# Altium project DAPLink.PrjPcb
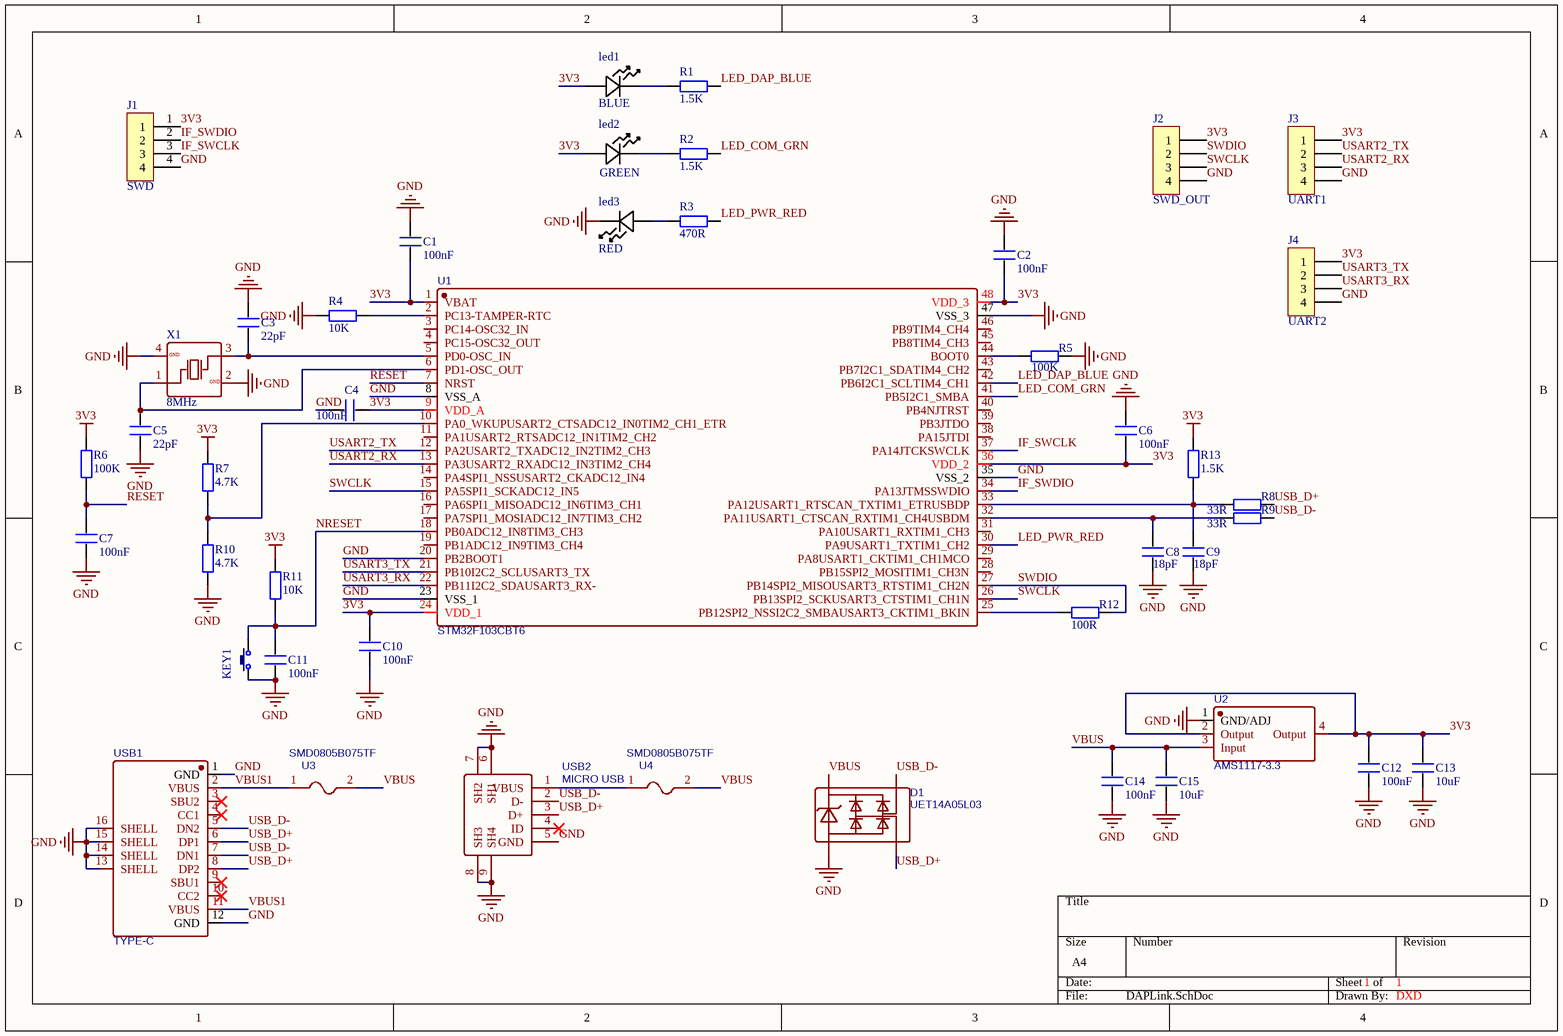
[diagram p0: DAPLink.SchDoc]
1 sheet, 44 parts. Net scope: global (net labels, ports and power ports of the same name join across sheets).
Board file: DAPLink.PcbDoc

## Sheet DAPLink.SchDoc
size A4; Author: DXD; DrawnBy: DXD; SheetNumber: 1; SheetTotal: 1

### Parts
C1  100nF  [0603_CAP]
C2  100nF  [0603_CAP]
C3  22pF  [0603_CAP]
C4  100nF  [0603_CAP]
C5  22pF  [0603_CAP]
C6  100nF  [0603_CAP]
C7  100nF  [0603_CAP]
C8  18pF  [0603_CAP]
C9  18pF  [0603_CAP]
C10  100nF  [0603_CAP]
C11  100nF  [0603_CAP]
C12  100nF  [0603_CAP]
C13  10uF  [0603_CAP]
C14  100nF  [0603_CAP]
C15  10uF  [0603_CAP]
D1  UET14A05L03  [SOT-143]
J1  SWD  [SWD]
J2  SWD_OUT  [XH2.54-4P]
J3  UART1  [XH2.54-4P]
J4  UART2  [XH2.54-4P]
KEY1  KEY  [KEY_TSW-2-2*4*3.5]  (value not drawn)
led1  BLUE  [0603_LED]
led2  GREEN  [0603_LED]
led3  RED  [0603_LED]
R1  1.5K  [0603_RES]
R2  1.5K  [0603_RES]
R3  470R  [0603_RES]
R4  10K  [0603_RES]
R5  100K  [0603_RES]
R6  100K  [0603_RES]
R7  4.7K  [0603_RES]
R8  33R  [0603_RES]
R9  33R  [0603_RES]
R10  4.7K  [0603_RES]
R11  10K  [0603_RES]
R12  100R  [0603_RES]
R13  1.5K  [0603_RES]
U1  STM32F103CBT6  [LQFP-48]
U2  AMS1117-3.3  [SOT-223]
U3  SMD0805B075TF  [F0805]
U4  SMD0805B075TF  [F0805]
USB1  TYPE-C  [TYPE-C]
USB2  MICRO USB  [MICRO-USB]
X1  8MHz  [XTAL-3225-4P]

### Nets
3V3: C1.1 C2.1 C4.1 C6.1 C10.2 C12.2 C13.2 J1.1 J2.1 J3.1 J4.1 led1.2 led2.2 R6.2 R7.2 R11.2 R13.2 U1.1(VBAT) U1.9(VDD_A) U1.24(VDD_1) U1.36(VDD_2) U1.48(VDD_3) U2.2(Output) U2.4(Output)
GND: C1.2 C2.2 C3.2 C4.2 C5.1 C6.2 C7.1 C8.1 C9.1 C10.1 C11.1 C12.1 C13.1 C14.1 C15.1 D1.1(A) J1.4 J2.4 J3.4 J4.4 KEY1.1 led3.1 R4.1 R5.2 R10.1 U1.8(VSS_A) U1.20(PB2BOOT1) U1.23(VSS_1) U1.35(VSS_2) U1.47(VSS_3) U2.1(GND/ADJ) USB1.1(GND) USB1.12(GND) USB1.13(SHELL) USB1.14(SHELL) USB1.15(SHELL) USB1.16(SHELL) USB2.5(GND) USB2.6(SH1) USB2.7(SH2) USB2.8(SH3) USB2.9(SH4) X1.2(GND) X1.4(GND)
IF_SWCLK: J1.3 U1.37(PA14JTCKSWCLK)
IF_SWDIO: J1.2 U1.34(PA13JTMSSWDIO)
LED_COM_GRN: R2.2 U1.41(PB5I2C1_SMBA)
LED_DAP_BLUE: R1.2 U1.42(PB6I2C1_SCLTIM4_CH1)
LED_PWR_RED: R3.2 U1.30(PA9USART1_TXTIM1_CH2)
NRESET: C11.2 KEY1.2 R11.1 U1.18(PB0ADC12_IN8TIM3_CH3)
RESET: C7.2 R6.1 U1.7(NRST)
SWCLK: J2.3 U1.15(PA5SPI1_SCKADC12_IN5) U1.26(PB13SPI2_SCKUSART3_CTSTIM1_CH1N)
SWDIO: J2.2 R12.2 U1.27(PB14SPI2_MISOUSART3_RTSTIM1_CH2N)
USART2_RX: J3.3 U1.13(PA3USART2_RXADC12_IN3TIM2_CH4)
USART2_TX: J3.2 U1.12(PA2USART2_TXADC12_IN2TIM2_CH3)
USART3_RX: J4.3 U1.22(PB11I2C2_SDAUSART3_RX-)
USART3_TX: J4.2 U1.21(PB10I2C2_SCLUSART3_TX)
USB_D+: D1.2 R8.2 USB1.6(DP1) USB1.8(DP2) USB2.3(D+)
USB_D-: D1.3 R9.2 USB1.5(DN2) USB1.7(DN1) USB2.2(D-)
VBUS: C14.2 C15.2 D1.4(K) U2.3(Input) U3.2 U4.2
VBUS1: U3.1 USB1.2(VBUS) USB1.11(VBUS)
NetC3_1: C3.1 U1.5(PD0-OSC_IN) X1.3(OSC2)
NetC5_2: C5.2 U1.6(PD1-OSC_OUT) X1.1(OSC1)
NetC8_2: C8.2 R9.1 U1.32(PA11USART1_CTSCAN_RXTIM1_CH4USBDM)
NetC9_2: C9.2 R8.1 R13.1 U1.33(PA12USART1_RTSCAN_TXTIM1_ETRUSBDP)
Netled1_1: led1.1 R1.1
Netled2_1: led2.1 R2.1
Netled3_2: led3.2 R3.1
NetR4_2: R4.2 U1.2(PC13-TAMPER-RTC)
NetR5_1: R5.1 U1.44(BOOT0)
NetR7_1: R7.1 R10.2 U1.10(PA0_WKUPUSART2_CTSADC12_IN0TIM2_CH1_ETR)
NetR12_1: R12.1 U1.25(PB12SPI2_NSSI2C2_SMBAUSART3_CKTIM1_BKIN)
NetU4_1: U4.1 USB2.1(VBUS)

Not connected (* = marked no-connect by the designer): U1 3(PC14-OSC32_IN) 4(PC15-OSC32_OUT) 11(PA1USART2_RTSADC12_IN1TIM2_CH2) 14(PA4SPI1_NSSUSART2_CKADC12_IN4) 16(PA6SPI1_MISOADC12_IN6TIM3_CH1) 17(PA7SPI1_MOSIADC12_IN7TIM3_CH2) 19(PB1ADC12_IN9TIM3_CH4) 28(PB15SPI2_MOSITIM1_CH3N) 29(PA8USART1_CKTIM1_CH1MCO) 31(PA10USART1_RXTIM1_CH3) 38(PA15JTDI) 39(PB3JTDO) 40(PB4NJTRST) 43(PB7I2C1_SDATIM4_CH2) 45(PB8TIM4_CH3) 46(PB9TIM4_CH4); USB1 3(SBU2)* 4(CC1)* 9(SBU1)* 10(CC2)*; USB2 4(ID)*

### Library data of the parts
C1-C15 = CAP: 无极性贴片电容; Manufacturer_Part_Number: 04023A0R3BAT2A; Vendor: AVX Corporation; Built_By: EMA_UL_Team; Type: DEV; C: Copyright (C) 2016 Accelerated Designs. All rights reserved; Copyright: Copyright (C) 2016 Accelerated Designs. All rights reserved; RefDes: RefDes; Value: Value
D1 = UET14A05L03: BOM_Manufacturer: Brightking; BOM_Supplier: LCSC; BOM_Manufacturer Part: UET14A05L03; BOM_Supplier Part: C78442; BOM_JLCPCB Part Class: Extended Part; spicePre: D; spiceSymbolName: UET14A05L03
J2-J4 = Header_1x4: 4P接插件; Manufacturer_Part_Number: 826629-4; Vendor: TE Connectivity; Built_By: EMA_UL_Team; C: Copyright (C) 2015 Accelerated Designs. All rights reserved; RefDes: RefDes; Type: DEV; Value: Value
KEY1 = KEY: 按键; BOM名称: 3x6轻触开关; 版权归属: 源创客; 学习资源: www.ooocke.com
led1-led3 = LED: 贴片发光二极管; Manufacturer_Part_Number: VLMB1310-GS08; Vendor: Vishay; Built_By: EMA_UL_Team; Type: DEV; C: Copyright (C) 2015 Accelerated Designs. All rights reserved; RefDes: RefDes; Value: Value
R1-R13 = RES: 贴片电阻; Manufacturer_Part_Number: RC0402FR-070RL; Vendor: Yageo; Built_By: EMA_UL_Team; C: Copyright (C) 2015 Accelerated Designs. All rights reserved; RefDes: RefDes; Type: DEV; Value: Value
U1 = STM32F103CBT6: BOM_Manufacturer: STMicroelectronics; timeStamp: 1458840421; BOM_Supplier: LCSC; BOM_Manufacturer Part: STM32F103CBT6; BOM_Supplier Part: C8304; BOM_JLCPCB Part Class: Extended Part; spicePre: U; spiceSymbolName: STM32F103CBT6
U2 = AMS1117-3.3: BOM_Manufacturer: KEXIN; Contributor: LCSC; SMT Type: Extend; BOM_Supplier: LCSC; BOM_Supplier Part: C369933; BOM_Manufacturer Part: AMS1117-3.3; BOM_LCSC Assembly: Yes; spicePre: U; spiceSymbolName: AMS1117-3.3_C369933
U3 U4 = SMD0805B075TF: BOM_Manufacturer: Brightking Elec (TAIWAN); Contributor: LCSC; BOM_Supplier: LCSC; BOM_Supplier Part: C269105; BOM_Manufacturer Part: SMD0805B075TF; BOM_JLCPCB Part Class: Extended Part; spicePre: U; spiceSymbolName: SMD0805B075TF
USB1 = TYPE-C: BOM_Manufacturer: 韩国韩荣; BOM_Manufacturer Part: TYPE-C-31-M-22; Contributor: LCSC; BOM_Supplier: LCSC; BOM_Supplier Part: C530612; spicePre: U; spiceSymbolName: TYPE-C-31-M-22
USB2 = MICRO USB: BOM_Manufacturer: SHOU HAN; BOM_Manufacturer Part: MicroQTJ; Contributor: LCSC; BOM_Supplier: LCSC; BOM_Supplier Part: C404968; BOM_JLCPCB Part Class: Extended Part; spicePre: U; spiceSymbolName: MICROQTJ
X1 = XTAL-4P: 4脚无源晶振